# Altium schematic sheet MCU.SchDoc
size A4
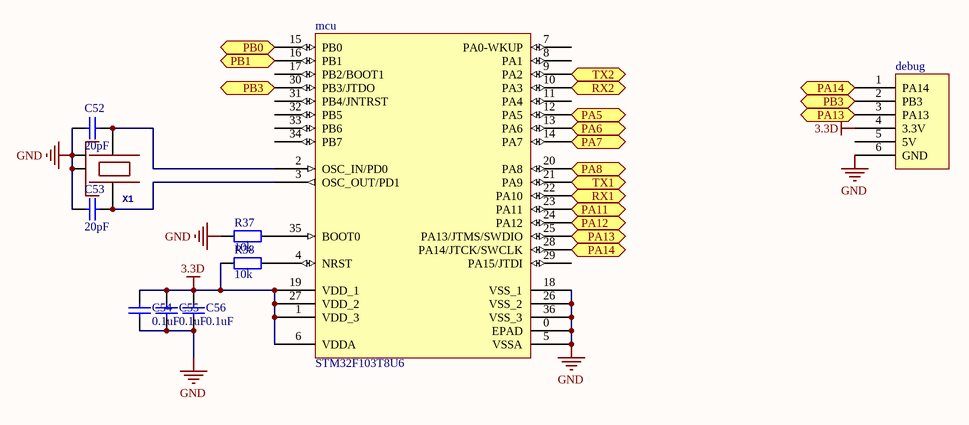
[diagram p0: MCU.SchDoc]

## Parts
C52  value 20pF  [0402]  (hidden comment: Cap)
C53  value 20pF  [0402]  (hidden comment: Cap)
C54  value 0.1uF  [0402]  (hidden comment: Cap)
C55  value 0.1uF  [0402]  (hidden comment: Cap)
C56  value 0.1uF  [0402]  (hidden comment: Cap)
debug  debug  [WFRSM125]  (value not drawn)
mcu  STM32F103T8U6  [VFQN36_V]
R37  value 10k  [0402]  (hidden comment: Res2)
R38  value 10k  [0402]  (hidden comment: Res2)
X1  24.000 KHz 3.2x2.5mm 8-10pf  [OSCILLATOR-3.2X2.5]  (value not drawn)

## Ports
PA5, PA6, PA7, PA8, PA11, PA12, PA13, PA14, PB0, PB1, PB3, RX1, RX2, TX1, TX2

## Nets
3.3D: C54.2 C55.2 C56.2 debug.4(3.3V) mcu.1(VDD_3) mcu.6(VDDA) mcu.19(VDD_1) mcu.27(VDD_2) R38.2
GND: C52.1 C53.1 C54.1 C55.1 C56.1 debug.6(GND) mcu.0(EPAD) mcu.5(VSSA) mcu.18(VSS_1) mcu.26(VSS_2) mcu.36(VSS_3) R37.2 X1.2(NC_2) X1.4(NC_4)
PA5: mcu.12(PA5) ; port PA5
PA6: mcu.13(PA6) ; port PA6
PA7: mcu.14(PA7) ; port PA7
PA8: mcu.20(PA8) ; port PA8
PA11: mcu.23(PA11) ; port PA11
PA12: mcu.24(PA12) ; port PA12
PA13: debug.3(PA13) mcu.25(PA13/JTMS/SWDIO) ; port PA13
PA14: debug.1(PA14) mcu.28(PA14/JTCK/SWCLK) ; port PA14
PB0: mcu.15(PB0) ; port PB0
PB1: mcu.16(PB1) ; port PB1
PB3: debug.2(PB3) mcu.30(PB3/JTDO) ; port PB3
RX1: mcu.22(PA10) ; port RX1
RX2: mcu.10(PA3) ; port RX2
TX1: mcu.21(PA9) ; port TX1
TX2: mcu.9(PA2) ; port TX2
NetC52_2: C52.2 mcu.2(OSC_IN/PD0) X1.1
NetC53_2: C53.2 mcu.3(OSC_OUT/PD1) X1.3
Netmcu_4: mcu.4(NRST) R38.1
Netmcu_35: mcu.35(BOOT0) R37.1

Not connected (* = marked no-connect by the designer): debug 5(5V); mcu 7(PA0-WKUP) 8(PA1) 11(PA4) 17(PB2/BOOT1) 29(PA15/JTDI) 31(PB4/JNTRST) 32(PB5) 33(PB6) 34(PB7)

## Library data of the parts
C52-C56 = Cap: Capacitor; Published: 8-Jun-2000; LatestRevisionDate: 17-Jul-2002; LatestRevisionNote: Re-released for DXP Platform.; PackageReference: RAD-0.3; Publisher: Altium Limited; PackageDescription: Radial Cap, Thru-Hole; 2 Leads; 0.3 in Pin Spacing
mcu = STM32F103T8U6: STM32 ARM-based 32-bit MCU with 64 Kbytes Flash, 36-pin VFQFPN, Industrial Temperature; Published: *; DatasheetVersion: *; PackageVersion: *; PackageReference: *; Publisher: *; PackageDescription: *; ComponentLink1Description: *; ComponentLink1URL: *; ComponentLink2Description: *; ComponentLink2URL: *
R37 R38 = Res2: Resistor; Published: 8-Jun-2000; LatestRevisionDate: 17-Jul-2002; LatestRevisionNote: Re-released for DXP Platform.; PackageReference: AXIAL-0.4; Publisher: Altium Limited; PackageDescription: Axial Device, Thru-Hole; 2 Leads; 0.4 in Pin Spacing
X1 = OSCILLATOR-3.2X2.5: Crystal Oscillator in 3.2x2.5 SMD